# Altium schematic sheet Sensing.SchDoc
size A4; SheetNumber: 4; SheetTotal: 5
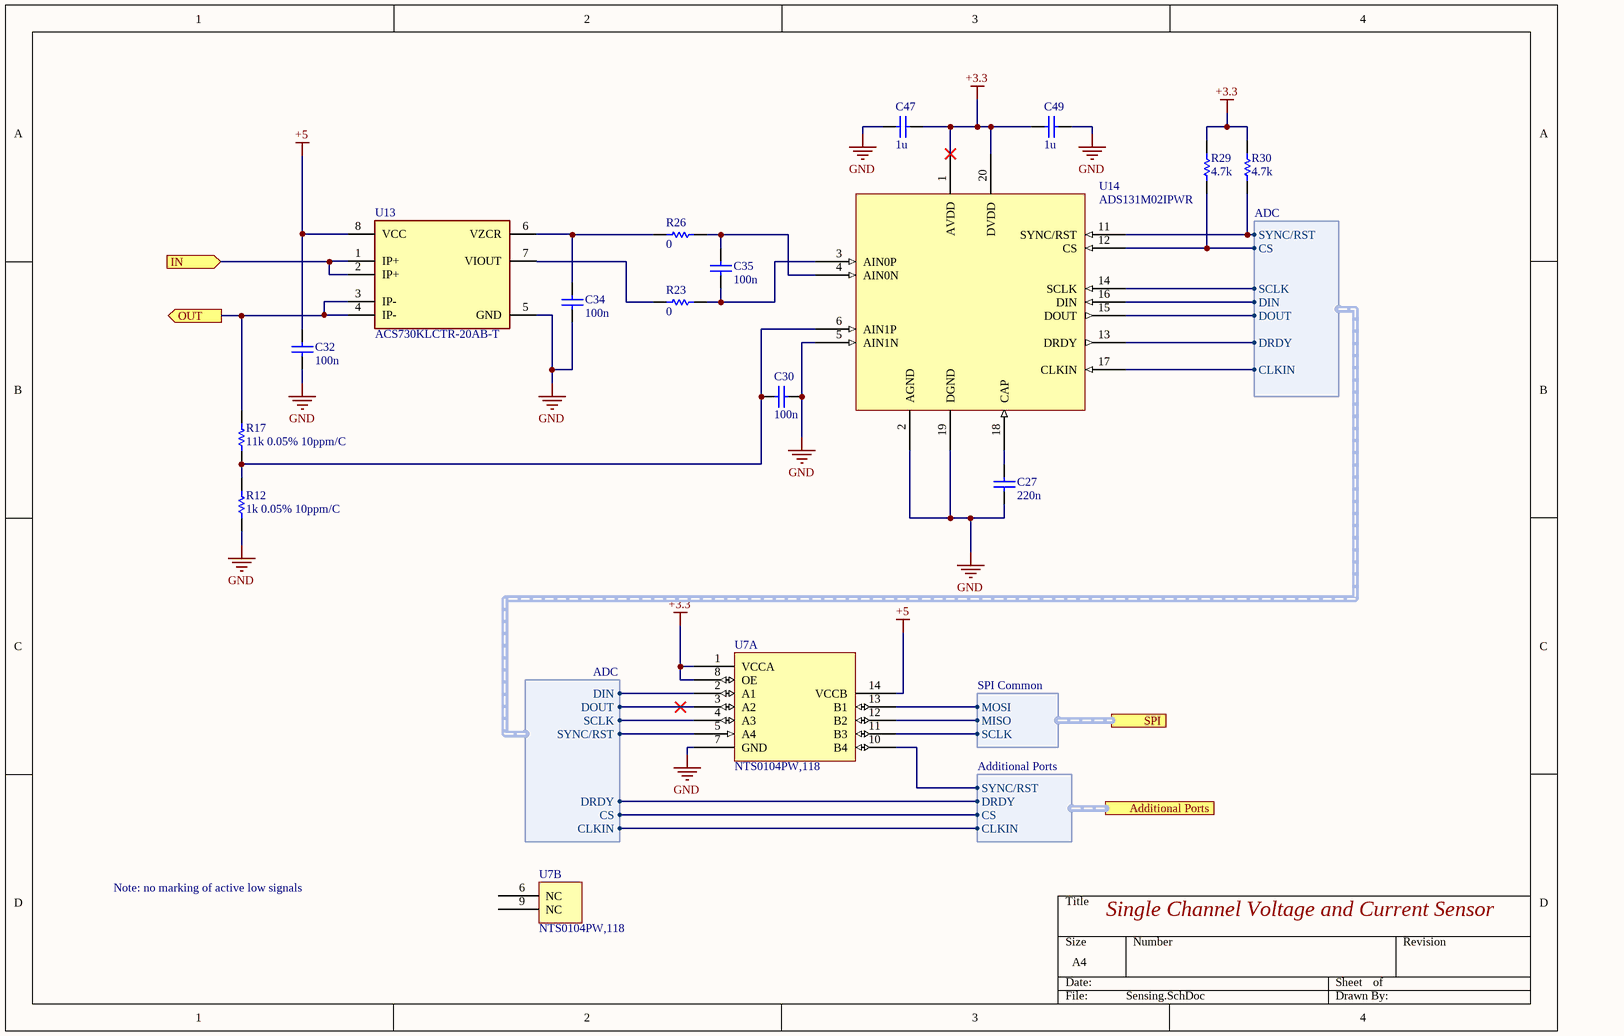
[diagram p0: Sensing.SchDoc]

## Parts
C27  220n  [CAPC2013X140X50NL20T25]
C30  100n  [CAPC2013X145X50NL20T25]
C32  100n  [CAPC2013X145X50LL20T25]
C34  100n  [CAPC2013X145X50LL20T25]
C35  100n  [CAPC2013X145X50LL20T25]
C47  1u  [CAPC2013X140X50LL20T25]
C49  1u  [CAPC2013X140X50LL20T25]
R12  1k 0.05% 10ppm/C  [RESC2013X55X40NL15T20]
R17  11k 0.05% 10ppm/C  [RESC2013X55X40NL15T20]
R23  0  [RESC2013X70X40NL20T20]
R26  0  [RESC2013X70X40NL20T20]
R29  4.7k  [RESC2013X70X40NL20T20]
R30  4.7k  [RESC2013X70X40NL20T20]
U7  NTS0104PW,118  [TSOP65P640X110-14N]  (parts A,B of 2)
U13  ACS730KLCTR-20AB-T  [FP-LC-8-IPC_B]
U14  ADS131M02IPWR  [TSOP65P640X120-20N]

## Ports
Additional Ports (harness Additional Ports), IN (in), OUT (out), SPI (harness SPI Common)

## Harnesses
ADC: SYNC/RST, CS, SCLK, DIN, DOUT, DRDY, CLKIN
ADC: CLKIN, CS, DIN, DOUT, DRDY, SCLK, SYNC/RST
Additional Ports: SYNC/RST, DRDY, CS, CLKIN
SPI Common: MISO, MOSI, SCLK

## Nets
+3.3: C47.1 C49.1 R29.2 R30.2 U7.1(VCCA) U7.8(OE) U14.1(AVDD) U14.20(DVDD)
+5: C32.1 U7.14(VCCB) U13.8(VCC)
GND: C27.1 C30.2 C32.2 C34.2 C47.2 C49.2 R12.1 U7.7(GND) U13.5(GND) U14.2(AGND) U14.5(AIN1N) U14.19(DGND)
IN: U13.1(IP+) U13.2(IP+) ; port IN
OUT: R17.2 U13.3(IP-) U13.4(IP-) ; port OUT
NetC27_2: C27.2 U14.18(CAP)
NetC30_1: C30.1 R12.2 R17.1 U14.6(AIN1P)
NetC34_1: C34.1 R26.2 U13.6(VZCR)
NetC35_1: C35.1 R26.1 U14.4(AIN0N)
NetC35_2: C35.2 R23.1 U14.3(AIN0P)
NetR23_2: R23.2 U13.7(VIOUT)
NetR29_1: R29.1 U14.12(CS) ; harness ADC.CS, port Additional Ports.CS
NetR30_1: R30.1 U7.5(A4) U14.11(SYNC/RST) ; harness ADC.SYNC/RST
NetU7_2: U7.2(A1) U14.16(DIN) ; harness ADC.DIN
NetU7_3: U7.3(A2) U14.15(DOUT) ; harness ADC.DOUT
NetU7_4: U7.4(A3) U14.14(SCLK) ; harness ADC.SCLK
NetU7_10: U7.10(B4) ; port Additional Ports.SYNC/RST
NetU7_11: U7.11(B3) ; port SPI.SCLK
NetU7_12: U7.12(B2) ; port SPI.MISO
NetU7_13: U7.13(B1) ; port SPI.MOSI
NetU14_13: U14.13(DRDY) ; harness ADC.DRDY, port Additional Ports.DRDY
NetU14_17: U14.17(CLKIN) ; harness ADC.CLKIN, port Additional Ports.CLKIN

Not connected (* = marked no-connect by the designer): U7 6(NC) 9(NC)

## Notes on the sheet
- Note: no marking of active low signals
- Single Channel Voltage and Current Sensor

## Library data of the parts
C27 = CMP-2007-04602-1: Manufacturer: AVX Interconnect / Elco; Part Number: 08053C224JAT2A
C30 C32 C34 C35 = CMP-2007-01136-1: Manufacturer: Kemet; Part Number: C0805C104K3RALTU
C47 C49 = CMP-2007-03234-1: Part Number: C0805C105K3RACTU; Manufacturer: Kemet
R12 = ERA6ARW102V: RES SMD 1K OHM 0.05% 1/8W 0805; Manufacturer: Panasonic; Resistance: 1kR; Power Rating: 125mW; Voltage Rating: 200V; Temperature Coefficient: 10ppm/°C; Voltage Rating (DC): 100V; Supplier 1: Digi-Key; Supplier Part Number 1: P1.0KBSCT-ND; Manufacturer Part Number: ERA6ARW102V; RoHS: Yes; Category: Chip SMD Resistors; Stock 1: 6885; Pricing 1: 1=0.74000, 10=0.61500, 100=0.41270, 1000=0.24145, 2500=0.23882 (USD); Mount: Surface Mount; Case/Package: 0805; Number of Pins: 2; Case Code (Metric): 2012; Case Code (Imperial): 0805; Weight: 0.000194oz; Contact Plating: Tin; Min Operating Temperature: -55°C; Max Operating Temperature: 155°C; Packaging: Tape and Reel; Tolerance: 0.05%; Package Quantity: 1; Resistor Type: Thin Film; Number of Terminations: 2; Termination: SMD/SMT; Max Power Dissipation: 125mW; Features: Automotive AEC-Q200; Series: ERA-6A; Construction: Rectangular; Resistance Tolerance: 0.05%; Length: 2mm; Width: 0.049inch; Height: 0.024inch; Depth: 1.25mm; Radiation Hardening: No; REACH SVHC: No SVHC; Military Standard: Not; Lead Free: Lead Free; RoHS Compliant: Yes; ComponentLink1URL: https://datasheet.ciiva.com/9117/aoa0000ce26-9117942.pdf?src-supplier=Avnet; ComponentLink1Description: https://datasheet.ciiva.com/9117/aoa0000ce26-9117942.pdf?src-supplier=Avnet; ComponentLink2URL: https://datasheet.ciiva.com/17215/aoa0000ce26-17215289.pdf?src-supplier=Avnet+Europe; ComponentLink2Description: https://datasheet.ciiva.com/17215/aoa0000ce26-17215289.pdf?src-supplier=Avnet+Europe
R17 = ERA6ARW113V: Res Thin Film 0805 11K Ohm 0.05% 1/8W 10ppm/C Molded SMD Punched Carrier T/R; Manufacturer: Panasonic; Resistance: 11kR; Power Rating: 125mW; Voltage Rating: 200V; Temperature Coefficient: 10ppm/°C; Supplier 1: Digi-Key; Supplier Part Number 1: P11KBSCT-ND; Manufacturer Part Number: ERA6ARW113V; RoHS: Yes; Category: Chip SMD Resistors; Stock 1: 1039; Pricing 1: 1=0.74000, 10=0.61500, 100=0.41270, 1000=0.24145, 2500=0.23882 (USD); Mount: Surface Mount; Case/Package: 0805; Case Code (Metric): 2012; Case Code (Imperial): 0805; Contact Plating: Tin; Min Operating Temperature: -55°C; Max Operating Temperature: 155°C; Package Quantity: 1; Packaging: Tape and Reel; Tolerance: 0.05%; Resistor Type: Thin Film,Metal Film; Number of Terminations: 2; Max Power Dissipation: 125mW; Features: Automotive AEC-Q200; Series: ERA-6A; Length: 0.079inch; Width: 0.049inch; Height: 0.024inch; Depth: 1.25mm; Radiation Hardening: No; Lead Free: Lead Free; RoHS Compliant: Yes; ComponentLink1URL: https://datasheet.ciiva.com/9193/aoa0000ce26-9193943.pdf?src-supplier=Avnet; ComponentLink1Description: https://datasheet.ciiva.com/9193/aoa0000ce26-9193943.pdf?src-supplier=Avnet; ComponentLink2URL: https://datasheet.ciiva.com/24042/aoa0000ce26-197354-24042121.pdf?src-supplier=Mouser; ComponentLink2Description: https://datasheet.ciiva.com/24042/aoa0000ce26-197354-24042121.pdf?src-supplier=Mouser; ComponentLink3URL: https://datasheet.ciiva.com/17211/aoa0000ce26-17211916.pdf?src-supplier=Avnet+Europe; ComponentLink3Description: https://datasheet.ciiva.com/17211/aoa0000ce26-17211916.pdf?src-supplier=Avnet+Europe
R23 R26 = CMP-1665-00002-5: Chip Resistor, 0 Ohm, +/- 1%, 0.125 W, -55 to 155 degC, 0805 (2012 Metric), RoHS, Tape and Reel; PartNumber: ERJ-6GEY0R00V; Tolerance: 5%; Resistance: 0 Ohm; REACH SVHC: No SVHC; Min Operating Temperature: -55 degC; Case/Package: 0805; Packaging: Tape and Reel; Package Quantity: 5000; ComponentLink1Description: Manufacturer URL; PackageDescription: 2-Pin Surface Mount Device, Body 2 x 1.25 mm; Mounting Technology: Surface Mount; Max Operating Temperature: 155 degC; Width: 1.25 mm; RoHSCompliant: True; Height: 0.6 mm; ComponentLink1URL: http://www.panasonic.com/; ComponentLink2URL: http://industrial.panasonic.com/cdbs/www-data/pdf/RDA0000/AOA0000C84.pdf; Case Code (Imperial): 0805; DatasheetVersion: 03/2015; Length: 2 mm; Case Code (Metric): 2012; ComponentLink2Description: Datasheet; Radiation Hardening: No
R29 R30 = CMP-2001-00420-1: Manufacturer: Panasonic; Part Number: ERJ-6GEYJ472V
U7 = NTS0104PW,118: Voltage Level Translator 14-Pin TSSOP T/R; Manufacturer: NXP Semiconductors; Max Supply Voltage: 5.5V; Min Supply Voltage: 1.65V; High Level Output Current: -20uA; Low Level Output Current: 1mA; Quiescent Current: 45uA; Propagation Delay: 280ns; Data Rate: 50Mbps; Number of Channels: 4; Max Power Dissipation: 250mW; Turn-On Delay Time: 5.8ns; Number of Elements: 1; Polarity: Non-Inverting; Operating Frequency-Max: 10MHz; Supplier 1: Digi-Key; RoHS: Yes; Category: Voltage Level Shifters; Stock 1: 15992; Pricing 1: 1=0.89000, 10=0.79100, 25=0.75120, 100=0.72820 (USD); Mount: Surface Mount; Case/Package: TSSOP; Number of Pins: 14; Min Operating Temperature: -40°C; Max Operating Temperature: 125°C; Logic Function: Translator; Packaging: Tape and Reel; Package Quantity: 1; Number of Bits: 4; Output Type: Voltage; Series: -; Radiation Hardening: No; RoHS Compliant: Yes; Lead Free: Lead Free; ComponentLink1URL: https://datasheet.ciiva.com/15096/getdatasheetpartid-507519-15096327.pdf?src-supplier=Verical; ComponentLink1Description: https://datasheet.ciiva.com/15096/getdatasheetpartid-507519-15096327.pdf?src-supplier=Verical; ComponentLink2URL: https://datasheet.ciiva.com/1899/nts0104-1899064.pdf?src-supplier=Digi-Key; ComponentLink2Description: https://datasheet.ciiva.com/1899/nts0104-1899064.pdf?src-supplier=Digi-Key; ComponentLink3URL: https://datasheet.ciiva.com/1899/nts0104-1899065.pdf?src-supplier=Digi-Key; ComponentLink3Description: https://datasheet.ciiva.com/1899/nts0104-1899065.pdf?src-supplier=Digi-Key; ComponentLink4URL: https://datasheet.ciiva.com/1899/nts0104-1899066.pdf?src-supplier=Digi-Key; ComponentLink4Description: https://datasheet.ciiva.com/1899/nts0104-1899066.pdf?src-supplier=Digi-Key; ComponentLink5URL: https://datasheet.ciiva.com/8244/nts0104-8244175.pdf?src-supplier=Avnet; ComponentLink5Description: https://datasheet.ciiva.com/8244/nts0104-8244175.pdf?src-supplier=Avnet; Manufacturer Part Number: NTS0104PW,118
U13 = CMP-82923-000147-1: 1MHZ BANDWIDTH INTEGRATED, HALL; Linearity: 0.75%; Polarity: Bidirectional; Number of Channels: 1; Max Supply Current: 25mA; Response Time: 700ns; Sensitivity: 100mV/A; Current Sensing: 20A; Accuracy: 3%; Frequency: 1MHz; Case/Package: SOIC; Packaging: Cut Tape; Min Operating Temperature: -40°C; RoHS Compliant: Yes; Mount: Surface Mount; Number of Pins: 8; Max Operating Temperature: 125°C
U14 = ADS131M02IPWR: Digital to Analog Converter; Manufacturer: Texas Instruments; Supplier 1: Mouser; RoHS: No; Stock 1: 1885; Pricing 1: 1=3.34000, 10=3.01000, 50=2.84000, 100=2.46000, 1000=1.79000, 10000=1.66000 (USD); Manufacturer Part Number: ADS131M02IPWR